# Altium project Fast_Servo.PrjPCB (part 7 of 7)

## Sheet USB.SchDoc: USB
size 420 x 297 mm; Date: 2018-12-27; Author: P. Zdunek; DrawnBy: P. Zdunek; Engineer: Vitali Tsiukala; Organization: Trenz Electronic GmbH; DocumentNumber: 12; Revision: 03; SheetNumber: 12; SheetTotal: 37; ModifiedBy: -; CheckedDate: -; Title2: Title 2; DivGrp: WUT ISE; Designer: G.Kasprowicz
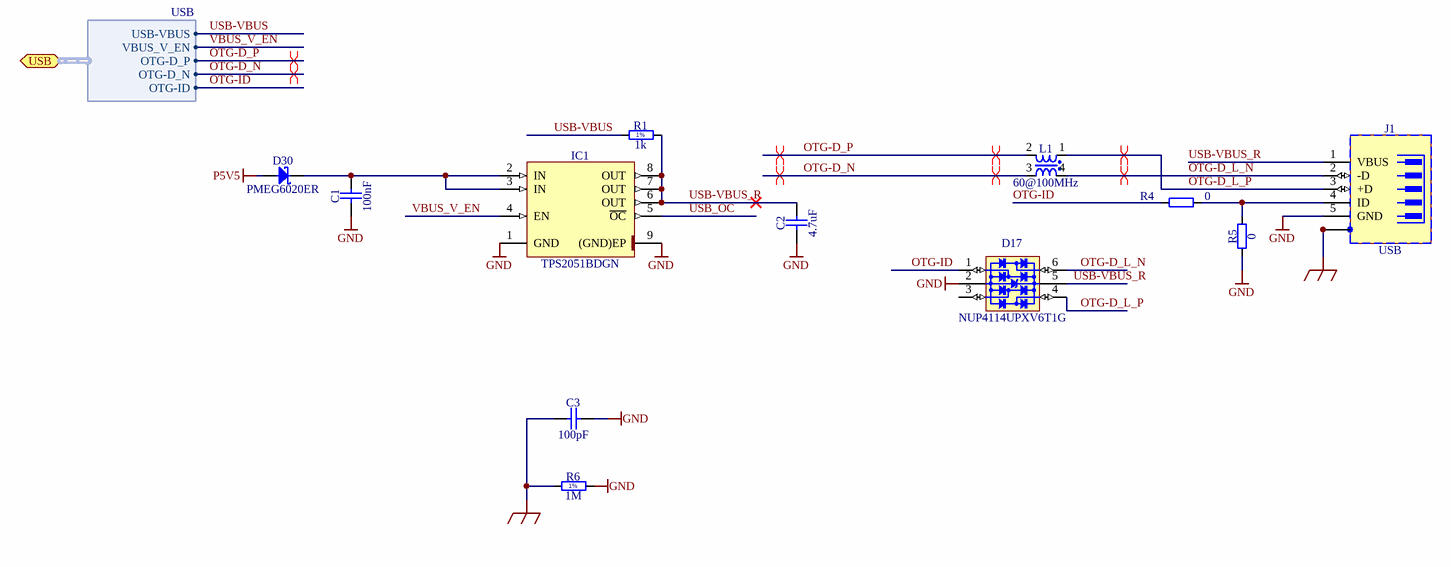
[diagram p24: USB.SchDoc]

### Parts
C1  100nF  [CAPC1005X55N]
C2  4.7uF  [CAPC1709X95N]
C3  100pF  [CAPC3216X180N]
D17  NUP4114UPXV6T1G  [SOTFL50P160X60-6N]
D30  PMEG6020ER  [SODFL3517X110N]
IC1  TPS2051BDGN  [SOP65P490X110-9N-R157X189]
J1  USB  [UJ2-MIBH-4-MSMT]
L1  60@100MHz  [IND_WURTH_WE-CNSW_0504]
R1  1k  [RESC1005X40N]
R4  0  [RESC1005X40N]
R5  0  [RESC1005X40N]
R6  1M  [RESC1005X40N]

### Ports
USB (bidir, harness USB)

### Harnesses
USB: USB-VBUS, VBUS_V_EN, OTG-D_P, OTG-D_N, OTG-ID

### Nets
FGND: C3.1 J1.6(SH) J1.7(SH) J1.8(SH) J1.9(SH) J1.10(SH) J1.11(SH) R6.1
GND: C1.1 C2.1 C3.2 D17.2(GND) IC1.1(GND) IC1.9((GND)EP) J1.5(GND) R5.1 R6.2
P5V5: D30.2(A)
OTG-D_L_N: D17.6(I/O4) J1.2(-D) L1.4
OTG-D_L_P: D17.4(I/O3) J1.3(+D) L1.1
OTG-D_N: L1.3 ; port USB.OTG-D_N
OTG-D_P: L1.2 ; port USB.OTG-D_P
OTG-ID: D17.1(I/O1) R4.1 ; port USB.OTG-ID
USB-VBUS: R1.1 ; port USB.USB-VBUS
USB-VBUS_R: C2.2 D17.5(VBUS) IC1.6(OUT) IC1.7(OUT) IC1.8(OUT) J1.1(VBUS) R1.2
USB_OC: IC1.5(~{OC})
VBUS_V_EN: IC1.4(EN) ; port USB.VBUS_V_EN
NetC1_2: C1.2 D30.1(C) IC1.2(IN) IC1.3(IN)
NetJ1_4: J1.4(ID) R4.2 R5.2

Not connected (* = marked no-connect by the designer): D17 3(I/O2)

### Layout directives
differential pair: OTG-D_L_N, OTG-D_L_P, OTG-D_N, OTG-D_P

### Notes on the sheet
- Project/Equipment
- Document
- Designer
- Drawn by
- Check.by
- Copyright WUT ISE 2020.
  This documentation describes Open Hardware and is licensed under the CERN OHL v.1.2. You may redistribute and modify this documentation under the terms of the CERN OHL v.1.2. (http://ohwr.org/CERNOHL). This documentation is distributed WITHOUT ANY EXPRESS OR IMPLIED WARRANTY, INCLUDING OF MERCHANTABILITY, SATISFACTORY QUALITY AND FITNESS FOR A PARTICULAR PURPOSE. Please see the CERN OHL v.1.2 for applicable conditions.
- Contact
- File
- Last Mod.
- Print Date
- Sheet
- Size
- A3
- of
- Rev
- (in symbol R0402_1K_1%_0.0625W_100PPM) 1%
- (in symbol R0402_1M_1%_0.0625W_100PPM) 1%

### Library data of the parts
C1 = CC0402_100NF_16V_10%_X5R: Non-polarised capacitor; Part Description: SMD Multilayer Chip Ceramic Capacitor; Manufacturer: GENERIC; Manufacturer1 Part Number: GRM155R61C104KA88D; Voltage: 16V; TC: X5R; Tolerance: ±10%; Part Number: CC0402_100NF_16V_10%_X5R; Component Kind: Standard; Component Type: Standard; Pin Count: 2; Value: 100nF; Status: None; Manufacturer Part Number: CC0402_100NF_16V_10%_X5R; Case: 0402; Mounted: Yes; Socket: No; SMD: Yes; Sense: No; Manufacturer1 Example: MURATA; Manufacturer1 ComponentHeight: 0.55mm; HelpURL: \\cern.ch\dfs\Applications\Altium\Datasheets\CC0402_X5R_MURATA_GRM.pdf; Author: CERN DEM JLC; CreateDate: 10-Dec-13; LatestRevisionDate: 10-Dec-13
C2 = CC0603_4.7UF_16V_10%_X5R: Non-polarised capacitor; Part Description: SMD Multilayer Chip Ceramic Capacitor; Manufacturer: GENERIC; Manufacturer1 Part Number: EMK107ABJ475KA-T; Voltage: 16V; TC: X5R; Tolerance: ±10%; Part Number: CC0603_4.7UF_16V_10%_X5R; Component Kind: Standard; Component Type: Standard; Pin Count: 2; Value: 4.7uF; Status: None; Manufacturer Part Number: CC0603_4.7UF_16V_10%_X5R; Case: 0603; Mounted: Yes; Socket: No; SMD: Yes; Sense: No; Manufacturer1 Example: TAIYO YUDEN; Manufacturer1 ComponentHeight: 0.95mm; HelpURL: \\cern.ch\dfs\Applications\Altium\Datasheets\CC0603_X7R_TAIYO-YUDEN_HIGH-VALUE.pdf; Author: CERN DEM JLC; CreateDate: 16-Dec-13; LatestRevisionDate: 16-Sep-14
C3 = CC1206_100PF_2KV_5%_C0G: Non-polarised capacitor; Part Description: High Voltage MLC Chip Capacitor; Manufacturer: GENERIC; Manufacturer1 Part Number: 1206GA101JAT2A; Voltage: 2kV; TC: C0G/NP0; Tolerance: ±5%; Part Number: CC1206_100PF_2KV_5%_C0G; Component Kind: Standard; Component Type: Standard; Pin Count: 2; Value: 100pF; Status: None; Manufacturer Part Number: CC1206_100PF_2KV_5%_C0G; Case: 1206; Mounted: Yes; Socket: No; SMD: Yes; Sense: No; Manufacturer1 Example: AVX; Manufacturer1 ComponentHeight: 1.8mm; HelpURL: \\cern.ch\dfs\Applications\Altium\Datasheets\CC1206_C0G_AVX_HV-MLC.pdf; Author: CERN DEM JLC; CreateDate: 17-May-17; LatestRevisionDate: 17-May-17
D17 = NUP4114UPXV6T1G: Part Description: ESD Protection Diodes Array (8kV) with Low Clamping Voltage; Manufacturer: ON SEMICONDUCTOR; Voltage: 5.5V; PressFit: No; Bonding: No; Part Number: NUP4114UPXV6T1G; Component Kind: Standard; Component Type: Standard; Device: NUP4114UPXV6T1G; PackageDescription: SOTFL (SOT666, SOT563,), 0.50mm, Pitch; 6 Pin, 1.20mm W X 1.60mm L X 0.60mm H Body, IPC Medium Density; Manufacturer Part Number: NUP4114UPXV6T1G; Pin Count: 8; Mounted: Yes; Socket: No; SMD: Yes; Sense: No; ComponentHeight: 1.75mm; HelpURL: \\cern.ch\dfs\Applications\Altium\Datasheets\NUP4114UPXV6T1G.pdf; Author: CERN DEM JLC; CreateDate: 05.12.2012; LatestRevisionDate: 05.12.2012
D30 = PMEG6020ER: Schottky Diode; Part Description: MEGA Schottky Barrier Rectifier; Manufacturer: NXP SEMICONDUCTORS; Voltage: 60V; Power: 2A; PressFit: No; Bonding: No; Part Number: PMEG6020ER; Component Kind: Standard; Component Type: Standard; Device: PMEG6020ER; PackageDescription: SODFL Diode (SOD123W); 2.60mm W X 1.70mm L X 1.10mm H body, IPC Medium Density; Manufacturer Part Number: PMEG6020ER; Pin Count: 2; Case: SOD-123FL; Mounted: Yes; Socket: No; SMD: Yes; Sense: No; ComponentHeight: 1.1mm; HelpURL: \\cern.ch\dfs\Applications\Altium\Datasheets\PMEG6020ER.pdf; Author: CERN DEM JMW; CreateDate: 19.06.2014; LatestRevisionDate: 19.06.2014
IC1 = TPS2051BDGN: One Channel, Current-Limited, Power-Distribution Switches; Part Description: One Channel, Current-Limited (500mA), Power-Distribution Switches; Manufacturer: TEXAS INSTRUMENTS; PressFit: No; Bonding: No; Part Number: TPS2051BDGN; Component Kind: Standard; Component Type: Standard; Device: TPS2051BDGN; PackageDescription: SOP, 0.65mm Pitch; 8 Pin, 3.00mm W X 3.00mm L X 1.10mm H body (w/Thermal Tab 1.57 X 1.89mm), IPC Medium Density; Manufacturer Part Number: TPS2051BDGN; Pin Count: 8; Case: SSOP8; Mounted: Yes; Socket: No; SMD: Yes; Sense: No; ComponentHeight: 1.1mm; Author: CERN DEM BC; HelpURL: \\cern.ch\dfs\Applications\Altium\Datasheets\TPS2051BDGN.pdf; CreateDate: 06/07/2020; LatestRevisionDate: 06/07/2020
J1 = CON_USB_UJ2-MIBH-4-MSMT: 5 Pin + 1 Shield  in-line USB Receptacle; Part Number: CUI_UJ2-MIBH-4-MSMT; Part Description: 0.65mm Pitch, Micro-USB Type B Surface Mounte Vertical Receptacle; Manufacturer: CUI; PressFit: No; Component Kind: Standard; Component Type: Standard; Pin Count: 11; Family: USB; Mounted: Yes; Socket: No; SMD: Yes; Sense: No; Status: None; Manufacturer Part Number: UJ2-MIBH-4-MSMT; ComponentHeight: 1.1; HelpURL: \\cern.ch\dfs\Applications\Altium\Datasheets\MOLEX_105133-0011.pdf; Author: GK; CreateDate: 13/12/2017; LatestRevisionDate: 13/12/2017
L1 = IND0504_WURTH_7442335600: Inductor Common Mode; Part Description: Common Mode SMD Line Filter (WE-CNSW Series); Manufacturer: WURTH ELEKTRONIK; Power: 600mA; Resistance: 0.22R; Tolerance: ±25%; Part Number: IND0504_WURTH_7442335600; Component Kind: Standard; Component Type: Standard; Pin Count: 4; Value: 60@100MHz; Status: None; Manufacturer Part Number: 7442335600; Case: 0504; Mounted: Yes; Socket: No; SMD: Yes; Sense: No; ComponentHeight: 1.1mm; HelpURL: \\cern.ch\dfs\Applications\Altium\Datasheets\IND0504_WURTH_7442335600.pdf; Author: CERN DEM BC; CreateDate: 21-Oct-19; LatestRevisionDate: 21-Oct-19
R1 = R0402_1K_1%_0.0625W_100PPM: Resistor - 1%; Part Description: General Purpose Thick Film Chip Resistor; Manufacturer: GENERIC; Manufacturer1 Part Number: 232270671002L; PressFit: No; TC: ±100ppm/°C; Part Number: R0402_1K_1%_0.0625W_100PPM; Component Kind: Standard; Component Type: Standard; Pin Count: 2; Value: 1k; Status: Not Recommended; Manufacturer Part Number: R0402_1K_1%_0.0625W_100PPM; Case: 0402; Mounted: Yes; Sense: No; Socket: No; SMD: Yes; Manufacturer1 Example: YAGEO PHYCOMP; Manufacturer1 ComponentHeight: 0.4mm; HelpURL: \\cern.ch\dfs\Applications\Altium\Datasheets\R0402_Phycomp_RC0402.pdf; Author: CERN DEM JLC; CreateDate: 03-Dec-07; LatestRevisionDate: 17-Oct-12; Power: 0.0625W; Tolerance: ±1%
R4 R5 = R0402_0R_JUMPER: Resistor; Part Description: 1A (0.05R Max DC Resistance) Zero Ohm Jumper; Manufacturer: GENERIC; Manufacturer1 Part Number: 232270591001L; PressFit: No; Part Number: R0402_0R_JUMPER; Component Kind: Standard; Component Type: Standard; Pin Count: 2; Value: 0; Status: Not Recommended; Manufacturer Part Number: R0402_0R_JUMPER; Case: 0402; Mounted: Yes; Sense: No; Socket: No; SMD: Yes; Manufacturer1 Example: YAGEO PHYCOMP; Manufacturer1 ComponentHeight: 0.4mm; HelpURL: \\cern.ch\dfs\Applications\Altium\Datasheets\R0402_Phycomp_RC0402.pdf; Author: CERN DEM JLC; CreateDate: 03-Dec-07; LatestRevisionDate: 17-Oct-12
R6 = R0402_1M_1%_0.0625W_100PPM: Resistor - 1%; Part Description: General Purpose Thick Film Chip Resistor; Manufacturer: GENERIC; Manufacturer1 Part Number: 232270671005L; PressFit: No; TC: ±100ppm/°C; Part Number: R0402_1M_1%_0.0625W_100PPM; Component Kind: Standard; Component Type: Standard; Pin Count: 2; Value: 1M; Status: Not Recommended; Manufacturer Part Number: R0402_1M_1%_0.0625W_100PPM; Case: 0402; Mounted: Yes; Sense: No; Socket: No; SMD: Yes; Manufacturer1 Example: YAGEO PHYCOMP; Manufacturer1 ComponentHeight: 0.4mm; HelpURL: \\cern.ch\dfs\Applications\Altium\Datasheets\R0402_Phycomp_RC0402.pdf; Author: CERN DEM JLC; CreateDate: 03-Dec-07; LatestRevisionDate: 17-Oct-12; Power: 0.0625W; Tolerance: ±1%

## Sheet DIGITAL_IOs.SchDoc: Digital Inputs
size 420 x 297 mm; Author: G.Kasprowicz; DrawnBy: G.Kasprowicz; Organization: Altium Limited; Address1: L3, 12a Rodborough Rd; Address2: Frenchs Forest; Address3: NSW; Address4: Australia 2086; DocumentNumber: 14; SheetNumber: 14; SheetTotal: 37; ModifiedBy: -; CheckedDate: -; Title2: Fast Stabilizer; DivGrp: WUT ISE; Designer: G.Kasprowicz
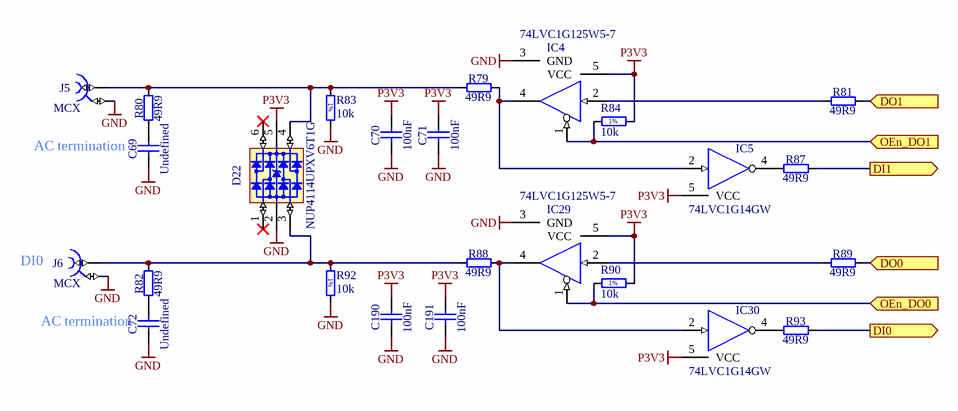
[diagram p25: DIGITAL_IOs.SchDoc]

### Parts
C69  Undefined  [CAPC1608X90N]
C70  100nF  [CAPC1005X55N]
C71  100nF  [CAPC1005X55N]
C72  Undefined  [CAPC1608X90N]
C190  100nF  [CAPC1005X55N]
C191  100nF  [CAPC1005X55N]
D22  NUP4114UPXV6T1G  [SOTFL50P160X60-6N]
IC4  74LVC1G125W5-7  [SOT95P280X145-5N]
IC5  74LVC1G14GW  [SOT65P212X110-5N]
IC29  74LVC1G125W5-7  [SOT95P280X145-5N]
IC30  74LVC1G14GW  [SOT65P212X110-5N]
J5  MCX  [AMPHENOL_919-383J-51A]
J6  MCX  [AMPHENOL_919-383J-51A]
R79  49R9  [RESC1005X40N]
R80  49R9  [RESC1005X40N]
R81  49R9  [RESC1005X40N]
R82  49R9  [RESC1005X40N]
R83  10k  [RESC1005X40N]
R84  10k  [RESC1005X40N]
R87  49R9  [RESC1005X40N]
R88  49R9  [RESC1005X40N]
R89  49R9  [RESC1005X40N]
R90  10k  [RESC1005X40N]
R92  10k  [RESC1005X40N]
R93  49R9  [RESC1005X40N]

### Ports
DI0 (out), DI1 (out), DO0 (in), DO1 (in), OEn_DO0 (in), OEn_DO1 (in)

### Nets
GND: C69.1 C70.1 C71.1 C72.1 C190.1 C191.1 D22.2(GND) IC4.3(GND) IC5.3(GND) IC29.3(GND) IC30.3(GND) J5.2 J6.2 R83.2 R92.2
P3V3: C70.2 C71.2 C190.2 C191.2 D22.5(VBUS) IC4.5(VCC) IC5.5(VCC) IC29.5(VCC) IC30.5(VCC) R84.2 R90.2
DI0: R93.2 ; port DI0
DI1: R87.2 ; port DI1
DO0: R89.2 ; port DO0
DO1: R81.2 ; port DO1
OEn_DO0: IC29.1(~{G}) R90.1 ; port OEn_DO0
OEn_DO1: IC4.1(~{G}) R84.1 ; port OEn_DO1
NetC69_2: C69.2 R80.1
NetC72_2: C72.2 R82.1
NetD22_3: D22.3(I/O2) J6.1 R82.2 R88.1 R92.1
NetD22_4: D22.4(I/O3) J5.1 R79.1 R80.2 R83.1
NetIC4_2: IC4.2(IN) R81.1
NetIC4_4: IC4.4(OUT) IC5.2(IN) R79.2
NetIC5_4: IC5.4(OUT) R87.1
NetIC29_2: IC29.2(IN) R89.1
NetIC29_4: IC29.4(OUT) IC30.2(IN) R88.2
NetIC30_4: IC30.4(OUT) R93.1

Not connected (* = marked no-connect by the designer): D22 1(I/O1)* 6(I/O4)*

### Notes on the sheet
- AC termination
- (near J6) DI0
- (near C72) AC termination
- Project/Equipment
- Document
- Designer
- Drawn by
- Check.by
- Copyright WUT ISE 2020.
  This documentation describes Open Hardware and is licensed under the CERN OHL v.1.2. You may redistribute and modify this documentation under the terms of the CERN OHL v.1.2. (http://ohwr.org/CERNOHL). This documentation is distributed WITHOUT ANY EXPRESS OR IMPLIED WARRANTY, INCLUDING OF MERCHANTABILITY, SATISFACTORY QUALITY AND FITNESS FOR A PARTICULAR PURPOSE. Please see the CERN OHL v.1.2 for applicable conditions.
- Contact
- File
- Last Mod.
- Print Date
- Sheet
- Size
- A3
- of
- Rev
- (in symbol R0402_10K_1%_0.0625W_100PPM) 1%

### Library data of the parts
C69 C72 = CC0603_NO-VALUE: Non-polarised capacitor; Part Description: Reserved Footprint For 0603(1608) Chip Ceramic Capacitor; Mounted: No; Part Number: CC0603_NO-VALUE; Component Kind: Standard; Component Type: Standard; Pin Count: 2; Value: Undefined; Status: None; Manufacturer: Undefined; Manufacturer Part Number: CC0603_NO-VALUE; Case: 0603; Socket: No; SMD: Yes; Sense: No; Manufacturer1 ComponentHeight: 0.9mm; HelpURL: Undefined; Author: CERN DEM MR; CreateDate: 22.11.2016; LatestRevisionDate: 22.11.2016
C70 C71 C190 C191 = CC0402_100NF_16V_10%_X7R: Non-polarised capacitor; Part Description: SMD Multilayer Chip Ceramic Capacitor; Manufacturer: GENERIC; Manufacturer1 Part Number: GRM155R71C104KA88D; Voltage: 16V; TC: X7R; Tolerance: ±10%; Part Number: CC0402_100NF_16V_10%_X7R; Component Kind: Standard; Component Type: Standard; Pin Count: 2; Value: 100nF; Status: Not Recommended; Manufacturer Part Number: CC0402_100NF_16V_10%_X7R; Case: 0402; Mounted: Yes; Socket: No; SMD: Yes; Sense: No; Manufacturer1 Example: MURATA; Manufacturer1 ComponentHeight: 0.55mm; HelpURL: \\cern.ch\dfs\Applications\Altium\Datasheets\CC0402_X7R_MURATA_GRM.pdf; Author: CERN DEM JLC; CreateDate: 05.12.2013; LatestRevisionDate: 03.12.2007
D22 = NUP4114UPXV6T1G: as D17 on sheet USB; Part Number: NUP4114UPXV6T1G; Component Kind: Standard; Component Type: Standard; Device: NUP4114UPXV6T1G; PackageDescription: SOTFL (SOT666, SOT563,), 0.50mm, Pitch; 6 Pin, 1.20mm W X 1.60mm L X 0.60mm H Body, IPC Medium Density; Manufacturer Part Number: NUP4114UPXV6T1G; Pin Count: 8; Mounted: Yes; Socket: No; SMD: Yes; Sense: No; ComponentHeight: 1.75mm; HelpURL: \\cern.ch\dfs\Applications\Altium\Datasheets\NUP4114UPXV6T1G.pdf; Author: CERN DEM JLC; CreateDate: 05.12.2012; LatestRevisionDate: 05.12.2012
IC4 IC29 = 74LVC1G125W5-7: Single Bus Buffer Gate With 3-State Output; Manufacturer: DIODES; PressFit: No; Bonding: No; Part Number: 74LVC1G125W5-7; Component Kind: Standard; Component Type: Standard; Device: 74LVC1G125W5-7; PackageDescription: SOT, 0.95mm Pitch; 5 Pin, 1.60mm W X 2.90mm L X 1.45mm H body, IPC Medium Density; Part Description: Single Bus Buffer Gate With 3-State Output; Manufacturer Part Number: 74LVC1G125W5-7; Pin Count: 5; Case: SOT23-5; Mounted: Yes; Socket: No; SMD: Yes; Sense: No; ComponentHeight: 1.45mm; Author: GK; HelpURL: \\cern.ch\dfs\Applications\Altium\Datasheets\SN74AHC1G125DBV.pdf; CreateDate: 18.05.2016; LatestRevisionDate: 18.05.2016
IC5 IC30 = 74LVC1G14GW: Single Schmitt-Trigger Inverter; Manufacturer: NXP SEMICONDUCTORS; PressFit: No; Bonding: No; Part Number: 74LVC1G14GW; Component Kind: Standard; Component Type: Standard; Device: 74LVC1G14GW; PackageDescription: SOT353, SC70-5, 0.65mm Pitch; 5 Pin, 1.25mm W X 2.05mm L X 1.10mm H body, IPC Medium Density; Part Description: Single Schmitt-trigger inverter; Manufacturer Part Number: 74LVC1G14GW; Pin Count: 4; Case: SOT353; Mounted: Yes; Socket: No; SMD: Yes; Sense: No; ComponentHeight: 1.1mm; Author: CERN DEM JLC; HelpURL: \\cern.ch\dfs\Applications\Altium\Datasheets\74LVC1G14GW.pdf; CreateDate: 04.07.2012; LatestRevisionDate: 04.07.2012
J5 J6 = AMPHENOL_919-383J-51A: Part Description: 50 Ohm, RF Connector, MCX Right Angle PCB Receptacle Jack; PressFit: No; Part Number: AMPHENOL_919-383J-51A; Component Kind: Standard; Component Type: Standard; Pin Count: 5; Family: MCX; Mounted: Yes; Socket: No; SMD: No; Sense: No; Status: None; Manufacturer: AMPHENOL; Manufacturer Part Number: 919-383J-51A; ComponentHeight: 6mm; HelpURL: \\cern.ch\dfs\Applications\Altium\Datasheets\AMPHENOL_919-383J-51A.pdf; Author: CERN DEM BC; CreateDate: 31.01.2019; LatestRevisionDate: 31.01.2019
R79-R82 R87-R89 R93 = R0402_49R9_1%_0.0625W_100PPM: Resistor - 1%; Part Description: General Purpose Thick Film Chip Resistor; Manufacturer: GENERIC; Manufacturer1 Part Number: 232270674999L or RC0402FR-0749R9L; TC: ±100ppm/°C; PressFit: No; Part Number: R0402_49R9_1%_0.0625W_100PPM; Component Kind: Standard; Component Type: Standard; Pin Count: 2; Value: 49R9; Status: Not Recommended; Power: 0.0625W; Tolerance: ±1%; Manufacturer Part Number: R0402_49R9_1%_0.0625W_100PPM; Case: 0402; Mounted: Yes; Sense: No; Socket: No; SMD: Yes; Manufacturer1 Example: YAGEO PHYCOMP; Manufacturer1 ComponentHeight: 0.4mm; HelpURL: \\cern.ch\dfs\Applications\Altium\Datasheets\R0402_Phycomp_RC0402.pdf; Author: CERN DEM JLC; CreateDate: 24.10.2012; LatestRevisionDate: 24.10.2012
R83 R84 R90 R92 = R0402_10K_1%_0.0625W_100PPM: Resistor - 1%; Part Description: General Purpose Thick Film Chip Resistor; Manufacturer: GENERIC; Manufacturer1 Part Number: 232270671003L; TC: ±100ppm/°C; Part Number: R0402_10K_1%_0.0625W_100PPM; Component Kind: Standard; Component Type: Standard; Pin Count: 2; Value: 10k; Status: Not recommended; Power: 0.0625W; Tolerance: ±1%; Manufacturer Part Number: R0402_10K_1%_0.0625W_100PPM; Case: 0402; Mounted: Yes; Sense: No; Socket: No; SMD: Yes; Manufacturer1 Example: YAGEO PHYCOMP; Manufacturer1 ComponentHeight: 0.4mm; HelpURL: \\cern.ch\dfs\Applications\Altium\Datasheets\R0402_Phycomp_RC0402.pdf; Author: CERN DEM JLC; CreateDate: 03.12.2007; LatestRevisionDate: 17.10.2012

## Sheet CON_JTAG_UART.SchDoc: JTAG, UART connectors
size 420 x 297 mm; DocumentNumber: 20; SheetNumber: 20; SheetTotal: 37; ModifiedBy: -; CheckedDate: -; Title2: Fast Stabilizer; DivGrp: WUT ISE; Designer: G.Kasprowicz
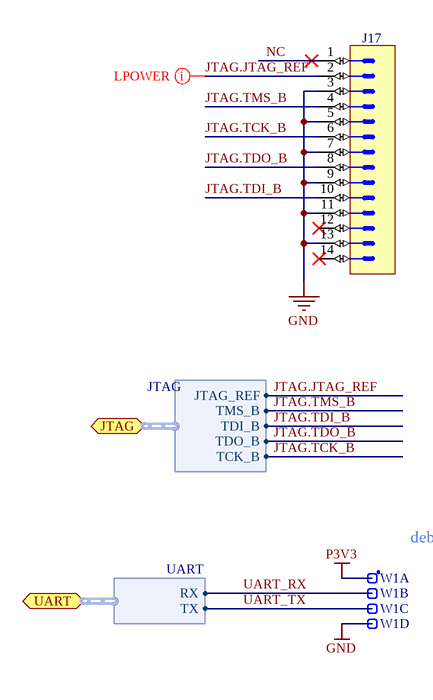
[diagram p26: CON_JTAG_UART.SchDoc]

### Parts
J17  Milli-Grid™  [MOLEX_87832-1420]  (value not drawn)
W1  Header 4  [SAMTEC_HTSW-104-23-L-S]  (value not drawn)  (parts A,B,C,D of 4)

### Ports
JTAG (bidir, harness JTAG), UART (bidir, harness UART)

### Harnesses
JTAG: JTAG_REF, TDO_B, TMS_B, TDI_B, TCK_B
UART: RX, TX

### Nets
GND: J17.3 J17.5 J17.7 J17.9 J17.11 J17.13 W1.4
P3V3: W1.1
JTAG.JTAG_REF: J17.2 ; port JTAG.JTAG_REF
JTAG.TCK_B: J17.6 ; port JTAG.TCK_B
JTAG.TDI_B: J17.10 ; port JTAG.TDI_B
JTAG.TDO_B: J17.8 ; port JTAG.TDO_B
JTAG.TMS_B: J17.4 ; port JTAG.TMS_B
NC: J17.1
UART_RX: W1.2 ; port UART.RX
UART_TX: W1.3 ; port UART.TX

Not connected (* = marked no-connect by the designer): J17 12* 14*

### Layout directives
net class Lpower: JTAG.JTAG_REF

### Notes on the sheet
- (near W1) debug UART
- Project/Equipment
- Document
- Designer
- Drawn by
- Check.by
- Copyright WUT ISE 2020.
  This documentation describes Open Hardware and is licensed under the CERN OHL v.1.2. You may redistribute and modify this documentation under the terms of the CERN OHL v.1.2. (http://ohwr.org/CERNOHL). This documentation is distributed WITHOUT ANY EXPRESS OR IMPLIED WARRANTY, INCLUDING OF MERCHANTABILITY, SATISFACTORY QUALITY AND FITNESS FOR A PARTICULAR PURPOSE. Please see the CERN OHL v.1.2 for applicable conditions.
- Contact
- File
- Last Mod.
- Print Date
- Sheet
- Size
- A3
- of
- Rev

### Library data of the parts
J17 = MOLEX_87832-1420: Connector 14 Male; Part Description: 2.00mm (.079") Pitch Milli-Grid™ Header, Surface Mount, Vertical, Shrouded, 14 Circuits,with Locking Windows and Centre Polarization Slot, PCB Locator; Manufacturer: MOLEX; PressFit: No; Part Number: MOLEX_87832-1420; Component Kind: Standard; Component Type: Standard; Pin Count: 14; Family: Milli-Grid™; Mounted: Yes; Socket: No; SMD: Yes; Sense: No; Status: None; Manufacturer Part Number: 87832-1420; ComponentHeight: 7.6mm; HelpURL: \\cern.ch\dfs\Applications\Altium\Datasheets\MOLEX_87832-1420.pdf; Author: CERN DEM JLC; CreateDate: 09-Sep-08; LatestRevisionDate: 09-Sep-08
W1 = SAMTEC_HTSW-104-23-L-S: 4 Mini Wire-Wrap Contact Strip Header; Part Description: 4 Contacts, Pitch 2.54mm, Single Row  Through Mount Straight Header (Post Lead 5.84mm, Tail Lead 2.92mm, Insulator 2.54mm); Manufacturer: SAMTEC; PressFit: No; Status Comment: High Temperature; Part Number: SAMTEC_HTSW-104-23-L-S; Component Kind: Standard; Component Type: Standard; Pin Count: 4; Family: Header 4; Mounted: Yes; Socket: No; Sense: No; SMD: No; Status: Preferred; Manufacturer Part Number: HTSW-104-23-L-S; ComponentHeight: 8.38mm; HelpURL: \\cern.ch\dfs\Applications\Altium\Datasheets\SAMTEC_HTSW-104-23-L-S.pdf; Author: CERN DEM JLC; CreateDate: 22/02/2018; LatestRevisionDate: 22/02/2018

## Nets that join several sheets
GND: TOP (10 pins), SOM_JB2 (20 pins), SOM_JB1 (25 pins), SOM_JB3 (17 pins), LEDS (6 pins), ADC (25 pins), Channel 2 (19 pins), Channel 1 (19 pins), DAC_AFE (11 pins), DAC (23 pins), CON_MEZZANINE_GPIO (10 pins), CON_EEM (9 pins), EEPROM_Sensors (14 pins), DAC_AUX (12 pins), CON_MEZZANINE_ANALOG (32 pins), ADC_AUX (19 pins), CLK_GEN (20 pins), CON_MEZZANINE_ADC_DAC (5 pins), CON_ETH (11 pins), POWER_SUPPLY (18 pins), PWR_SMPS (42 pins), PWR_P12V0A_N12V0A (43 pins), PWR_LDOs (50 pins), SD_CARD (9 pins), USB (9 pins), DIGITAL_IOs (15 pins), CON_JTAG_UART (7 pins)
N2V5A: DAC_AFE (14 pins), POWER_SUPPLY (R111.2 TP8.1), PWR_LDOs (5 pins)
N5V0A: Channel 2 (C37A.2 C51A.2 IC28A.4 IC28A.12), Channel 1 (C37B.2 C51B.2 IC28B.4 IC28B.12), POWER_SUPPLY (R113.2 TP9.1), PWR_LDOs (5 pins)
N5V5: POWER_SUPPLY (R109.2 TP7.1), PWR_SMPS (10 pins), PWR_LDOs (L18.1 L19.1)
N12V0A: CON_MEZZANINE_ANALOG (J3.26), CON_MEZZANINE_ADC_DAC (J16.16), PWR_P12V0A_N12V0A (5 pins)
P1V8: SOM_JB2 (5 pins), SOM_JB1 (R185.2), ADC (C36.2 IC2.34 R184.2), DAC_AFE (R68.2 R78.2), CLK_GEN (R173.1 R174.1), POWER_SUPPLY (T3.1 TP6.1), PWR_SMPS (C106.2 L15.2 R132.2), PWR_P12V0A_N12V0A (R152.2 R177.2), SD_CARD (C78.2 IC6.5)
P1V8_SOM_OUT: SOM_JB1 (JB1.40), PWR_SMPS (R137.1 R188.1)
P1V8A: ADC (8 pins), CLK_GEN (18 pins), POWER_SUPPLY (T4.1 TP11.1), PWR_LDOs (5 pins)
P2V5: SOM_JB2 (R210.1), PWR_SMPS (C107.2 L16.2 R202.2)
P2V5A: DAC_AFE (14 pins), POWER_SUPPLY (R106.2 TP3.1), PWR_LDOs (5 pins)
P3V3: SOM_JB2 (5 pins), SOM_JB1 (17 pins), LEDS (6 pins), CON_MEZZANINE_GPIO (J4.34), EEPROM_Sensors (R221.1 R222.1), DAC_AUX (6 pins), CON_MEZZANINE_ANALOG (8 pins), ADC_AUX (5 pins), CON_ETH (C73.1 C189.1 D13.5 D16.5), POWER_SUPPLY (R104.2 R105.2 R115.1 TP5.1), PWR_SMPS (8 pins), PWR_P12V0A_N12V0A (R146.2), PWR_LDOs (L21.1 L22.1), SD_CARD (5 pins), DIGITAL_IOs (11 pins), CON_JTAG_UART (W1.1)
P3V3_MP: CON_EEM (J2.30), EEPROM_Sensors (11 pins), POWER_SUPPLY (R110.1), PWR_SMPS (D26.1)
P3V3A: Channel 2 (C48A.2 C49A.2 IC27A.3), Channel 1 (C48B.2 C49B.2 IC27B.3), DAC (5 pins), ADC_AUX (C86.2 C87.2 IC33.3), CLK_GEN (5 pins), POWER_SUPPLY (R112.1 TP4.1), PWR_LDOs (5 pins)
P5V0A: ADC (C32.2 C33.2 IC32.3), Channel 2 (6 pins), Channel 1 (6 pins), POWER_SUPPLY (R108.1 TP2.1), PWR_LDOs (5 pins)
P5V5: POWER_SUPPLY (R114.1 TP10.1), PWR_SMPS (15 pins), PWR_LDOs (L17.1 L20.1), USB (D30.2)
P5V5A: DAC_AUX (C91.2 C92.2 IC34.24), PWR_SMPS (C120.2 C121.2 L7.2)
P12V0: CON_MEZZANINE_GPIO (J4.31 J4.32 J4.33), CON_EEM (J2.28 J2.29), POWER_SUPPLY (5 pins), PWR_SMPS (6 pins), PWR_P12V0A_N12V0A (6 pins)
P12V0A: EEPROM_Sensors (R123.2 R124.2), CON_MEZZANINE_ANALOG (J3.25), CON_MEZZANINE_ADC_DAC (J16.15), PWR_P12V0A_N12V0A (6 pins)
PWR_BANK13: SOM_JB2 (5 pins), LEDS (R100.1 R102.1), Channel 2 (R53A.1), Channel 1 (R53B.1), CLK_GEN (C161.2 IC20.23)
REF_P1V0: DAC (C11.2 IC26.4 R19.1), DAC_AUX (R22.2)
ADC_0_N: TOP (J18.2), Channel 1 (L2B.1 R49B.2 R54B.1), CON_MEZZANINE_ADC_DAC (J16.3)
ADC_0_P: TOP (J18.1), Channel 1 (L2B.2 R57B.2 SW2B.1), CON_MEZZANINE_ADC_DAC (J16.2)
ADC_1_N: TOP (J20.2), Channel 2 (L2A.1 R49A.2 R54A.1), CON_MEZZANINE_ADC_DAC (J16.6)
ADC_1_P: TOP (J20.1), Channel 2 (L2A.2 R57A.2 SW2A.1), CON_MEZZANINE_ADC_DAC (J16.5)
ADC_AFE_CH1_nSHDN: SOM_JB2 (JB2.97), Channel 1 (IC27B.7 R53B.2)
ADC_AFE_CH2_nSHDN: SOM_JB2 (JB2.95), Channel 2 (IC27A.7 R53A.2)
ADC_AUX_A0: SOM_JB1 (JB1.71), ADC_AUX (IC33.25)
ADC_AUX_A1: SOM_JB1 (JB1.84), ADC_AUX (IC33.24)
ADC_AUX_A2: SOM_JB1 (JB1.82), ADC_AUX (IC33.23)
ADC_AUX_CH1_N: CON_MEZZANINE_ANALOG (C13.2 R25.1), ADC_AUX (IC33.9)
ADC_AUX_CH1_P: CON_MEZZANINE_ANALOG (C12.2 R23.1), ADC_AUX (IC33.10)
ADC_AUX_CH2_N: CON_MEZZANINE_ANALOG (C17.2 R33.1), ADC_AUX (IC33.17)
ADC_AUX_CH2_P: CON_MEZZANINE_ANALOG (C16.2 R31.1), ADC_AUX (IC33.18)
ADC_AUX_CH3_N: CON_MEZZANINE_ANALOG (C15.2 R29.1), ADC_AUX (IC33.7)
ADC_AUX_CH3_P: CON_MEZZANINE_ANALOG (C14.2 R27.1), ADC_AUX (IC33.8)
ADC_AUX_DOUTA: SOM_JB1 (JB1.78), ADC_AUX (IC33.30)
ADC_AUX_DOUTB: SOM_JB1 (JB1.67), ADC_AUX (IC33.28)
ADC_AUX_N: CON_MEZZANINE_GPIO (J4.29), ADC_AUX (IC33.15)
ADC_AUX_nCS: SOM_JB1 (JB1.76), ADC_AUX (IC33.26)
ADC_AUX_P: CON_MEZZANINE_GPIO (J4.28), ADC_AUX (IC33.16)
ADC_AUX_RANGE: SOM_JB1 (JB1.87), ADC_AUX (IC33.21 R119.2)
ADC_AUX_SCLK: SOM_JB1 (JB1.95), ADC_AUX (R118.1)
ADC_AUX_SGL: SOM_JB1 (JB1.79), ADC_AUX (IC33.22)
ADC_CH1.SIG_N: ADC (IC2.12), Channel 1 (R52B.2)
ADC_CH1.SIG_P: ADC (IC2.11), Channel 1 (R47B.2)
ADC_CH2.SIG_N: ADC (IC2.4), Channel 2 (R52A.2)
ADC_CH2.SIG_P: ADC (IC2.3), Channel 2 (R47A.2)
ADC_CS: SOM_JB2 (JB2.32), ADC (IC2.19 TP25.1)
ADC_CTRL.DCO_N: SOM_JB2 (JB2.47), ADC (IC2.35)
ADC_CTRL.DCO_P: SOM_JB2 (JB2.45), ADC (IC2.36)
ADC_CTRL.FR_N: SOM_JB2 (JB2.37), ADC (IC2.31)
ADC_CTRL.FR_P: SOM_JB2 (JB2.35), ADC (IC2.32)
ADC_SCK: SOM_JB2 (JB2.34), ADC (IC2.20 TP26.1)
ADC_SDI: SOM_JB2 (JB2.36), ADC (IC2.21 TP27.1)
ADC_SDO: SOM_JB2 (JB2.38), ADC (IC2.46 R184.1 TP28.1)
AFE_GAIN_X10: SOM_JB1 (JB1.47), Channel 2 (R40A.1 R58A.1)
AFE_GAIN_X10: SOM_JB1 (JB1.49), Channel 1 (R40B.1 R58B.1)
AT_EVENT: SOM_JB2 (JB2.27), PWR_P12V0A_N12V0A (IC14.4 R152.1)
CLK2_N: SOM_JB2 (JB2.52), CLK_GEN (IC20.24)
CLK2_P: SOM_JB2 (JB2.54), CLK_GEN (IC20.25)
DAC_0_N: TOP (J15.2 R189.2), DAC_AFE (L3.4 R66.2), CON_MEZZANINE_ADC_DAC (J16.9)
DAC_0_P: TOP (J15.1), DAC_AFE (L3.3 R60.2), CON_MEZZANINE_ADC_DAC (J16.8)
DAC_1_N: TOP (J19.2 R190.2), DAC_AFE (L4.4 R76.2), CON_MEZZANINE_ADC_DAC (J16.12)
DAC_1_P: TOP (J19.1), DAC_AFE (L4.3 R70.2), CON_MEZZANINE_ADC_DAC (J16.11)
DAC_AFE_CH1_nPD: SOM_JB2 (JB2.26), DAC_AFE (IC3.14 R68.1)
DAC_AFE_CH2_nPD: SOM_JB2 (JB2.28), DAC_AFE (IC3.20 R78.1)
DAC_AUX_BIN: SOM_JB1 (JB1.75), DAC_AUX (IC34.5 R121.1)
DAC_AUX_nCLR: SOM_JB1 (JB1.85), DAC_AUX (IC34.11 R122.1)
DAC_AUX_nLDAC: SOM_JB1 (JB1.93), DAC_AUX (IC34.10 R120.1)
DAC_AUX_nSYNC: SOM_JB1 (JB1.77), DAC_AUX (IC34.7)
DAC_AUX_SCLK: SOM_JB1 (JB1.81), DAC_AUX (IC34.8)
DAC_AUX_SDIN: SOM_JB1 (JB1.97), DAC_AUX (IC34.9)
DAC_AUX_SDO: SOM_JB1 (JB1.99), DAC_AUX (IC34.16)
DAC_CLKIN: DAC (IC31.18), CLK_GEN (R172.2)
DAC_DATA0: SOM_JB3 (JB3.58), DAC (IC31.15)
DAC_DATA1: SOM_JB3 (JB3.57), DAC (IC31.14)
DAC_DATA2: SOM_JB3 (JB3.51), DAC (IC31.13)
DAC_DATA3: SOM_JB3 (JB3.53), DAC (IC31.12)
DAC_DATA4: SOM_JB3 (JB3.49), DAC (IC31.11)
DAC_DATA5: SOM_JB3 (JB3.43), DAC (IC31.10)
DAC_DATA6: SOM_JB3 (JB3.39), DAC (IC31.9)
DAC_DATA7: SOM_JB3 (JB3.44), DAC (IC31.8)
DAC_DATA8: SOM_JB3 (JB3.38), DAC (IC31.4)
DAC_DATA9: SOM_JB3 (JB3.47), DAC (IC31.3)
DAC_DATA10: SOM_JB3 (JB3.42), DAC (IC31.2)
DAC_DATA11: SOM_JB3 (JB3.41), DAC (IC31.1)
DAC_DATA12: SOM_JB3 (JB3.37), DAC (IC31.40)
DAC_DATA13: SOM_JB3 (JB3.40), DAC (IC31.39)
DAC_DCLKIO: SOM_JB3 (JB3.59), DAC (IC31.16)
DAC_nCS: SOM_JB2 (JB2.12), DAC (IC31.38 TP24.1)
DAC_RESET: SOM_JB3 (JB3.60), DAC (IC31.35 R20.2 TP29.1)
DAC_SCLK: SOM_JB2 (JB2.24), DAC (IC31.36 TP22.1)
DAC_SDIO: SOM_JB2 (JB2.14), DAC (IC31.37 TP23.1)
DI0: SOM_JB1 (JB1.37), DIGITAL_IOs (R93.2)
DI1: SOM_JB1 (JB1.36), DIGITAL_IOs (R87.2)
DO0: SOM_JB1 (JB1.51), DIGITAL_IOs (R89.2)
DO1: SOM_JB1 (JB1.48), DIGITAL_IOs (R81.2)
ENC_N: ADC (C21.2), CLK_GEN (IC20.19)
ENC_P: ADC (C20.2), CLK_GEN (IC20.20)
ETH_LED1: SOM_JB1 (JB1.39), CON_ETH (R91.1)
ETH_LED2: SOM_JB1 (JB1.35), CON_ETH (R85.1)
FP_LED_0: SOM_JB2 (JB2.72), LEDS (T11.1)
FP_LED_1: SOM_JB2 (JB2.74), LEDS (T12.1)
FP_LED_2: SOM_JB2 (JB2.85), LEDS (T9.1)
FP_LED_3: SOM_JB2 (JB2.87), LEDS (T10.1)
HRTIM_CHA1: SOM_JB1 (JB1.32), CON_MEZZANINE_GPIO (J4.14)
HRTIM_CHA2: SOM_JB1 (JB1.46), CON_MEZZANINE_GPIO (J4.15)
HRTIM_CHE1: SOM_JB1 (JB1.38), CON_MEZZANINE_GPIO (J4.11)
HRTIM_CHE2: SOM_JB1 (JB1.34), CON_MEZZANINE_GPIO (J4.12)
I2C1_SCL: SOM_JB1 (JB1.69), CON_MEZZANINE_GPIO (J4.27)
I2C1_SDA: SOM_JB1 (JB1.65), CON_MEZZANINE_GPIO (J4.26)
I2C_SCL: CON_EEM (J2.27), EEPROM_Sensors (5 pins)
I2C_SDA: CON_EEM (J2.26), EEPROM_Sensors (5 pins)
IOUT_N: DAC_AFE (C62.2 R71.1), DAC (IC31.29 R9.2 R10.1)
IOUT_P: DAC_AFE (C62.1 R75.1), DAC (IC31.28 R7.1 R8.2)
JTAG.JTAG_REF: SOM_JB2 (JB2.92), CON_JTAG_UART (J17.2)
JTAG.TCK_B: SOM_JB2 (JB2.100), CON_JTAG_UART (J17.6)
JTAG.TDI_B: SOM_JB2 (JB2.96), CON_JTAG_UART (J17.10)
JTAG.TDO_B: SOM_JB2 (JB2.98), CON_JTAG_UART (J17.8)
JTAG.TMS_B: SOM_JB2 (JB2.94), CON_JTAG_UART (J17.4)
LPTIM2_OUT: SOM_JB1 (JB1.44), CON_MEZZANINE_GPIO (J4.17)
LVDS0_N: SOM_JB2 (JB2.53), CON_EEM (J2.3)
LVDS0_P: SOM_JB2 (JB2.51), CON_EEM (J2.2)
LVDS1_N: SOM_JB2 (JB2.93), CON_EEM (J2.6)
LVDS1_P: SOM_JB2 (JB2.91), CON_EEM (J2.5)
LVDS2_N: SOM_JB2 (JB2.88), CON_EEM (J2.9)
LVDS2_P: SOM_JB2 (JB2.86), CON_EEM (J2.8)
LVDS3_N: SOM_JB2 (JB2.83), CON_EEM (J2.12)
LVDS3_P: SOM_JB2 (JB2.81), CON_EEM (J2.11)
LVDS4_N: SOM_JB2 (JB2.84), CON_EEM (J2.15)
LVDS4_P: SOM_JB2 (JB2.82), CON_EEM (J2.14)
LVDS5_N: SOM_JB2 (JB2.78), CON_EEM (J2.18)
LVDS5_P: SOM_JB2 (JB2.76), CON_EEM (J2.17)
LVDS6_N: SOM_JB2 (JB2.68), CON_EEM (J2.21)
LVDS6_P: SOM_JB2 (JB2.66), CON_EEM (J2.20)
LVDS7_N: SOM_JB2 (JB2.64), CON_EEM (J2.24)
LVDS7_P: SOM_JB2 (JB2.62), CON_EEM (J2.23)
NetIC20_30: SOM_JB2 (JB2.21), CLK_GEN (IC20.30)
NetIC20_31: SOM_JB2 (JB2.23), CLK_GEN (IC20.31)
OEn_DO0: SOM_JB1 (JB1.41), DIGITAL_IOs (IC29.1 R90.1)
OEn_DO1: SOM_JB1 (JB1.45), DIGITAL_IOs (IC4.1 R84.1)
OTG-D_N: SOM_JB3 (JB3.50), USB (L1.3)
OTG-D_P: SOM_JB3 (JB3.48), USB (L1.2)
OTG-ID: SOM_JB3 (JB3.52), USB (D17.1 R4.1)
OUT1A_N: SOM_JB2 (JB2.56), ADC (IC2.43)
OUT1A_P: SOM_JB2 (JB2.58), ADC (IC2.44)
OUT1B_N: SOM_JB2 (JB2.46), ADC (IC2.41)
OUT1B_P: SOM_JB2 (JB2.48), ADC (IC2.42)
OUT1C_N: SOM_JB2 (JB2.42), ADC (IC2.39)
OUT1C_P: SOM_JB2 (JB2.44), ADC (IC2.40)
OUT1D_N: SOM_JB2 (JB2.33), ADC (IC2.37)
OUT1D_P: SOM_JB2 (JB2.31), ADC (IC2.38)
OUT2A_N: SOM_JB2 (JB2.43), ADC (IC2.29)
OUT2A_P: SOM_JB2 (JB2.41), ADC (IC2.30)
OUT2B_N: SOM_JB2 (JB2.57), ADC (IC2.27)
OUT2B_P: SOM_JB2 (JB2.55), ADC (IC2.28)
OUT2C_N: SOM_JB2 (JB2.63), ADC (IC2.25)
OUT2C_P: SOM_JB2 (JB2.61), ADC (IC2.26)
OUT2D_N: SOM_JB2 (JB2.67), ADC (IC2.23)
OUT2D_P: SOM_JB2 (JB2.65), ADC (IC2.24)
P3V3_POWER_OK: PWR_SMPS (IC10.14 R136.2), PWR_P12V0A_N12V0A (T8.1)
PHY_MDI0_N: SOM_JB1 (JB1.5), CON_ETH (D16.4 R95.1)
PHY_MDI0_P: SOM_JB1 (JB1.3), CON_ETH (D16.6 R94.1)
PHY_MDI1_N: SOM_JB1 (JB1.11), CON_ETH (D16.1 R195.1)
PHY_MDI1_P: SOM_JB1 (JB1.9), CON_ETH (D16.3 R194.1)
PHY_MDI2_N: SOM_JB1 (JB1.17), CON_ETH (D13.1 R197.1)
PHY_MDI2_P: SOM_JB1 (JB1.15), CON_ETH (D13.3 R196.1)
PHY_MDI3_N: SOM_JB1 (JB1.23), CON_ETH (D13.4 R199.1)
PHY_MDI3_P: SOM_JB1 (JB1.21), CON_ETH (D13.6 R198.1)
POE_VC+: CON_ETH (D14.1 D15.1 D18.1), PWR_P12V0A_N12V0A (L8.1 R144.2)
POE_VC-: CON_ETH (D18.2 D19.2 D20.2), PWR_P12V0A_N12V0A (5 pins)
PWR_EN: SOM_JB1 (D31.1), EEPROM_Sensors (R226.2 R228.2), PWR_SMPS (IC15.2), PWR_P12V0A_N12V0A (D32.1), PWR_LDOs (IC9.3 IC16.3 IC18.3 IC19.3)
QOUT_N: DAC_AFE (C54.2 R61.1), DAC (IC31.22 R12.1 R14.2)
QOUT_P: DAC_AFE (C54.1 R65.1), DAC (IC31.23 R11.1 R13.2)
QSPI_CLK: SOM_JB1 (JB1.52), CON_MEZZANINE_GPIO (J4.8)
QSPI_IO0: SOM_JB1 (JB1.50), CON_MEZZANINE_GPIO (J4.6)
QSPI_IO1: SOM_JB1 (JB1.56), CON_MEZZANINE_GPIO (J4.5)
QSPI_IO2: SOM_JB1 (JB1.58), CON_MEZZANINE_GPIO (J4.3)
QSPI_IO3: SOM_JB1 (JB1.60), CON_MEZZANINE_GPIO (J4.2)
QSPI_NCS: SOM_JB1 (JB1.42), CON_MEZZANINE_GPIO (J4.9)
SD_CLK: SOM_JB1 (JB1.28), SD_CARD (IC6.9)
SD_CMD: SOM_JB1 (JB1.26), SD_CARD (IC6.4)
SD_DAT0: SOM_JB1 (JB1.24), SD_CARD (IC6.6)
SD_DAT1: SOM_JB1 (JB1.22), SD_CARD (IC6.7)
SD_DAT2: SOM_JB1 (JB1.20), SD_CARD (IC6.1)
SD_DAT3: SOM_JB1 (JB1.18), SD_CARD (IC6.3)
SI5340_LOS_XAXBb: SOM_JB2 (JB2.16), CLK_GEN (IC20.28)
SI5340_nINTR: SOM_JB2 (JB2.22), CLK_GEN (IC20.33)
Si5340_nLOL: SOM_JB2 (JB2.18), CLK_GEN (IC20.27)
SI5340_nRST: SOM_JB2 (JB2.25), CLK_GEN (IC20.17)
SI5340_SCL: SOM_JB2 (JB2.13), CLK_GEN (IC20.14 R173.2 TP21.1)
SI5340_SDA: SOM_JB2 (JB2.15), CLK_GEN (IC20.13 R174.2 TP20.1)
SoC_I2C_SCL: SOM_JB1 (R3.1), EEPROM_Sensors (R222.2 T14.2)
SoC_I2C_SDA: SOM_JB1 (R2.1), EEPROM_Sensors (R221.2 T13.2)
SPI1_MISO: SOM_JB1 (JB1.57), CON_MEZZANINE_GPIO (J4.21)
SPI1_MOSI: SOM_JB1 (JB1.55), CON_MEZZANINE_GPIO (J4.20)
SPI1_NSS: SOM_JB1 (JB1.59), CON_MEZZANINE_GPIO (J4.23)
SPI1_SCK: SOM_JB1 (JB1.61), CON_MEZZANINE_GPIO (J4.24)
TERM_STAT0: SOM_JB2 (JB2.77), LEDS (R100.2 T1.1), Channel 1 (SW2B.2)
TERM_STAT1: SOM_JB2 (JB2.75), LEDS (R102.2 T2.1), Channel 2 (SW2A.2)
UART4_TX: SOM_JB1 (JB1.72 R193.2), CON_MEZZANINE_GPIO (J4.18)
UART_RX: SOM_JB1 (JB1.96), CON_JTAG_UART (W1.2)
UART_TX: SOM_JB1 (JB1.94), CON_JTAG_UART (W1.3)
USB-VBUS: SOM_JB3 (JB3.56), USB (R1.1)
VBUS_V_EN: SOM_JB3 (JB3.54), USB (IC1.4)
VCM1: ADC (C26.2 IC2.1), Channel 2 (C46A.2 IC27A.2)
VCM2: ADC (C27.2 IC2.14), Channel 1 (C46B.2 IC27B.2)
VOUTA: DAC_AUX (IC34.3), CON_MEZZANINE_ANALOG (R35.1)
VOUTB: DAC_AUX (IC34.23), CON_MEZZANINE_ANALOG (R37.1)

## Assembly variants
Fast_Servo_Default: not fitted J10 J11 L3 L4 R2 R3 R5 R19 R49A R49B R57A R57B R64 R74 R147 R156 R176 R185 R209